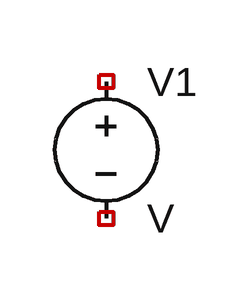
[diagram p0: schematic Draft1.asc]
Draft1.asc, the LTspice schematic file:
Version 4.1
SHEET 1 880 680
SYMBOL voltage 176 112 R0
SYMATTR InstName V1

The netlist it stands for:
* Draft1.asc
V1 NC_01 NC_02 V
.backanno
.end